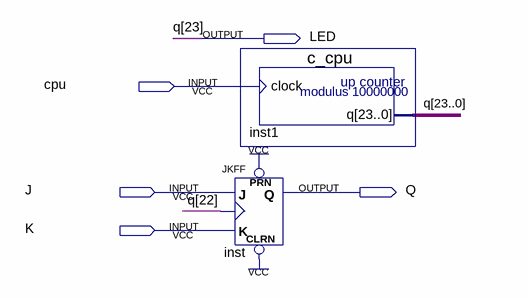
[diagram p0: schematic sheet]
// Quartus schematic jkf.bdf as structural Verilog: 2 symbols, 5 pins
module jkf (
  input  cpu,
  input  J,
  input  K,
  output LED,
  output Q
);

  wire [22:0] Q_bus;

  c_cpu inst1 (.clock(cpu), .q({LED, Q_bus}));
  JKFF inst (.PRN(1'b1), .CLRN(1'b1), .K(K), .J(J), .CLK(Q_bus[22]), .Q(Q));

  // Other names for the same wires on the sheet: Q[23] = LED
endmodule
